# Altium schematic sheet BANK0.SchDoc
size A4
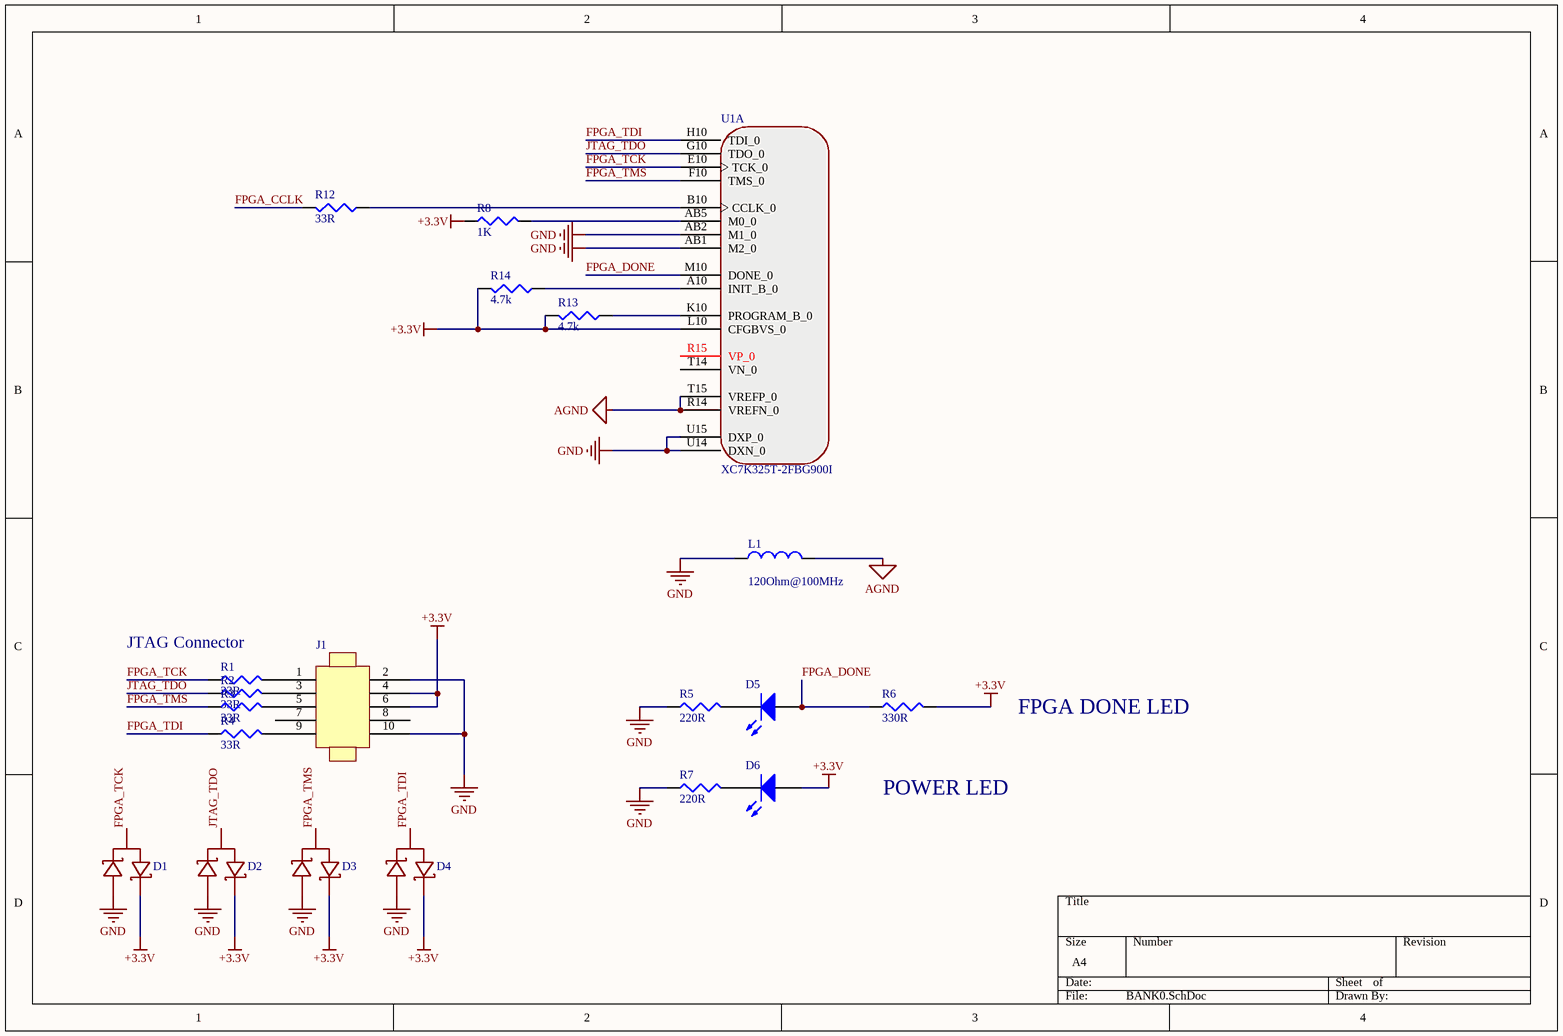
[diagram p0: BANK0.SchDoc]

## Parts
D1  BAT5S  [SOT-23]  (value not drawn)
D2  BAT5S  [SOT-23]  (value not drawn)
D3  BAT5S  [SOT-23]  (value not drawn)
D4  BAT5S  [SOT-23]  (value not drawn)
D5  LED3  [3.5X2.8X1.9]  (value not drawn)
D6  LED3  [3.5X2.8X1.9]  (value not drawn)
J1  JTAG-10  [JTAG-10]  (value not drawn)
L1  value 120Ohm@100MHz  [0402-A]  (hidden comment: Inductor)
R1  value 33R  [J1-0603]  (hidden comment: Res3)
R2  value 33R  [J1-0603]  (hidden comment: Res3)
R3  value 33R  [J1-0603]  (hidden comment: Res3)
R4  value 33R  [J1-0603]  (hidden comment: Res3)
R5  value 220R  [J1-0603]  (hidden comment: Res3)
R6  value 330R  [J1-0603]  (hidden comment: Res3)
R7  value 220R  [J1-0603]  (hidden comment: Res3)
R8  value 1K  [J1-0603]  (hidden comment: Res3)
R12  value 33R  [J1-0603]  (hidden comment: Res3)
R13  value 4.7k  [J1-0603]  (hidden comment: Res3)
R14  value 4.7k  [J1-0603]  (hidden comment: Res3)
U1  XC7K325T-2FBG900I  [FBG900]  (part A of 17)

## Nets
+3.3V: D1.2(K2) D2.2(K2) D3.2(K2) D4.2(K2) D6.1(A) J1.4 J1.6 R6.2 R8.1 R13.2 R14.2 U1.L10(CFGBVS_0)
AGND: L1.2 U1.R14(VREFN_0) U1.T15(VREFP_0)
GND: D1.1(A1) D2.1(A1) D3.1(A1) D4.1(A1) J1.2 J1.10 L1.1 R5.1 R7.1 U1.AB1(M2_0) U1.AB2(M1_0) U1.U14(DXN_0) U1.U15(DXP_0)
FPGA_CCLK: R12.2
FPGA_DONE: D5.1(A) R6.1 U1.M10(DONE_0)
FPGA_TCK: D1.3(A) R1.1 U1.E10(TCK_0)
FPGA_TDI: D4.3(A) R4.1 U1.H10(TDI_0)
FPGA_TMS: D3.3(A) R3.1 U1.F10(TMS_0)
JTAG_TDO: D2.3(A) R2.1 U1.G10(TDO_0)
NetD5_2: D5.2(K) R5.2
NetD6_2: D6.2(K) R7.2
NetJ1_1: J1.1 R1.2
NetJ1_3: J1.3 R2.2
NetJ1_5: J1.5 R3.2
NetJ1_9: J1.9 R4.2
NetR8_2: R8.2 U1.AB5(M0_0)
NetR12_1: R12.1 U1.B10(CCLK_0)
NetR13_1: R13.1 U1.K10(PROGRAM_B_0)
NetR14_1: R14.1 U1.A10(INIT_B_0)

Not connected (* = marked no-connect by the designer): J1 7 8; U1 R15(VP_0) T14(VN_0)

## Notes on the sheet
- JTAG Connector
- FPGA DONE LED
- POWER LED

## Library data of the parts
D5 D6 = LED3: Typical BLUE SiC LED; Published: 8-Jun-2000; LatestRevisionDate: 17-Dec-2003; LatestRevisionNote: PCB Footprint replaced.; DatasheetVersion: 16-Apr-2002; PackageVersion: 16-Apr-2002; PackageReference: 3.5X2.8X1.9; Publisher: Altium Limited; PackageDescription: SM LED; 2 C-Bend Leads; Body 3.5 x 2.8 x 1.9 mm, inc leads (LxWxH typ)
L1 = Inductor: Code_IEC: 1005; Published: 8-Jun-2000; LatestRevisionDate: 29-May-2009; LatestRevisionNote: IPC-7351 Footprint Added.; PackageReference: 0402-A; Publisher: Altium Limited; PackageDescription: Chip Inductor; Code_JEITA: 0402
R1-R8 R12-R14 = Res3: Resistor; Published: 8-Jun-2000; LatestRevisionDate: 29-May-2009; LatestRevisionNote: IPC-7351 Footprint Added.; PackageReference: J1-0603; Publisher: Altium Limited; PackageDescription: Chip Resistor